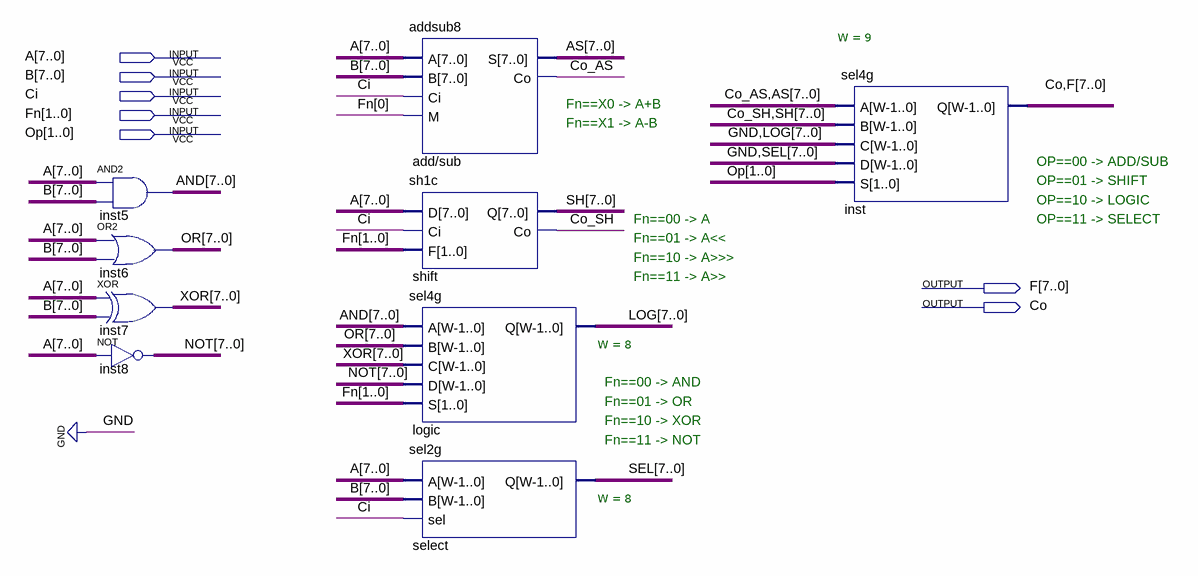
[diagram p0: schematic sheet]
// Quartus schematic alucomb.bdf as structural Verilog: 9 symbols, 7 pins
module alucomb (
  input  [7:0] A,
  input  [7:0] B,
  input  Ci,
  input  [1:0] Fn,
  input  [1:0] Op,
  output [7:0] F,
  output Co
);

  wire Co_AS, Co_SH;
  wire [7:0] AND, AS, LOG, NOT, OR, SEL, SH, XOR;

  assign AND = A & B;  // AND2 inst5, 8 bits wide
  assign OR = A | B;  // OR2 inst6, 8 bits wide
  assign XOR = A ^ B;  // XOR inst7, 8 bits wide
  assign NOT = ~A;  // NOT inst8, 8 bits wide
  addsub8 \add/sub  (.A(A), .B(B), .Ci(Ci), .M(Fn[0]), .S(AS), .Co(Co_AS));
  sh1c shift (.D(A), .Ci(Ci), .F(Fn), .Q(SH), .Co(Co_SH));
  sel4g #(.W(8)) \logic  (.A(AND), .B(OR), .C(XOR), .D(NOT), .S(Fn), .Q(LOG));
  sel2g #(.W(8)) select (.A(A), .B(B), .sel(Ci), .Q(SEL));
  sel4g #(.W(9)) inst (.A({Co_AS, AS}), .B({Co_SH, SH}), .C({1'b0, LOG}), .D({1'b0, SEL}), .S(Op), .Q({Co, F}));

  // Notes on the sheet:
  //   Fn==X0 -> A+B
  //   Fn==X1 -> A-B
  //   OP==00 -> ADD/SUB
  //   OP==01 -> SHIFT
  //   OP==10 -> LOGIC
  //   Fn==00 -> A
  //   OP==11 -> SELECT
  //   Fn==01 -> A<<
  //   Fn==10 -> A>>>
  //   Fn==11 -> A>>
  //   Fn==00 -> AND
  //   Fn==01 -> OR
  //   Fn==10 -> XOR
  //   Fn==11 -> NOT
endmodule
